# Altium schematic sheet REB215_XPRO_A_Connector.SchDoc: REB215_XPRO_A_Extension_Schematic
size A3; Organization: ATMEL R&D India; Address1: Kandanchavadi; Address3: Chennai; DocumentNumber: A09-2353; Revision: 2; SheetNumber: 2; SheetTotal: 3; PageSetup: Record=PageOptions|CenterHorizontal=True|CenterVertical=True|PrintScale=1.01|XCorrection=1.00|YCorrection=1.00|PrintKind=1|BorderSize=5000000|LeftOffset=0|BottomOffset=0|Orientation=2|PaperLength=1000|PaperWidth=1000|Scale=100|PaperSource=7|PrintQuality=-4|MediaType=1|DitherType=10|PaperKind=A3 (297 x 420 mm)|PrintScaleMode=1; DocumentName: REB215_XPRO_Extension_A
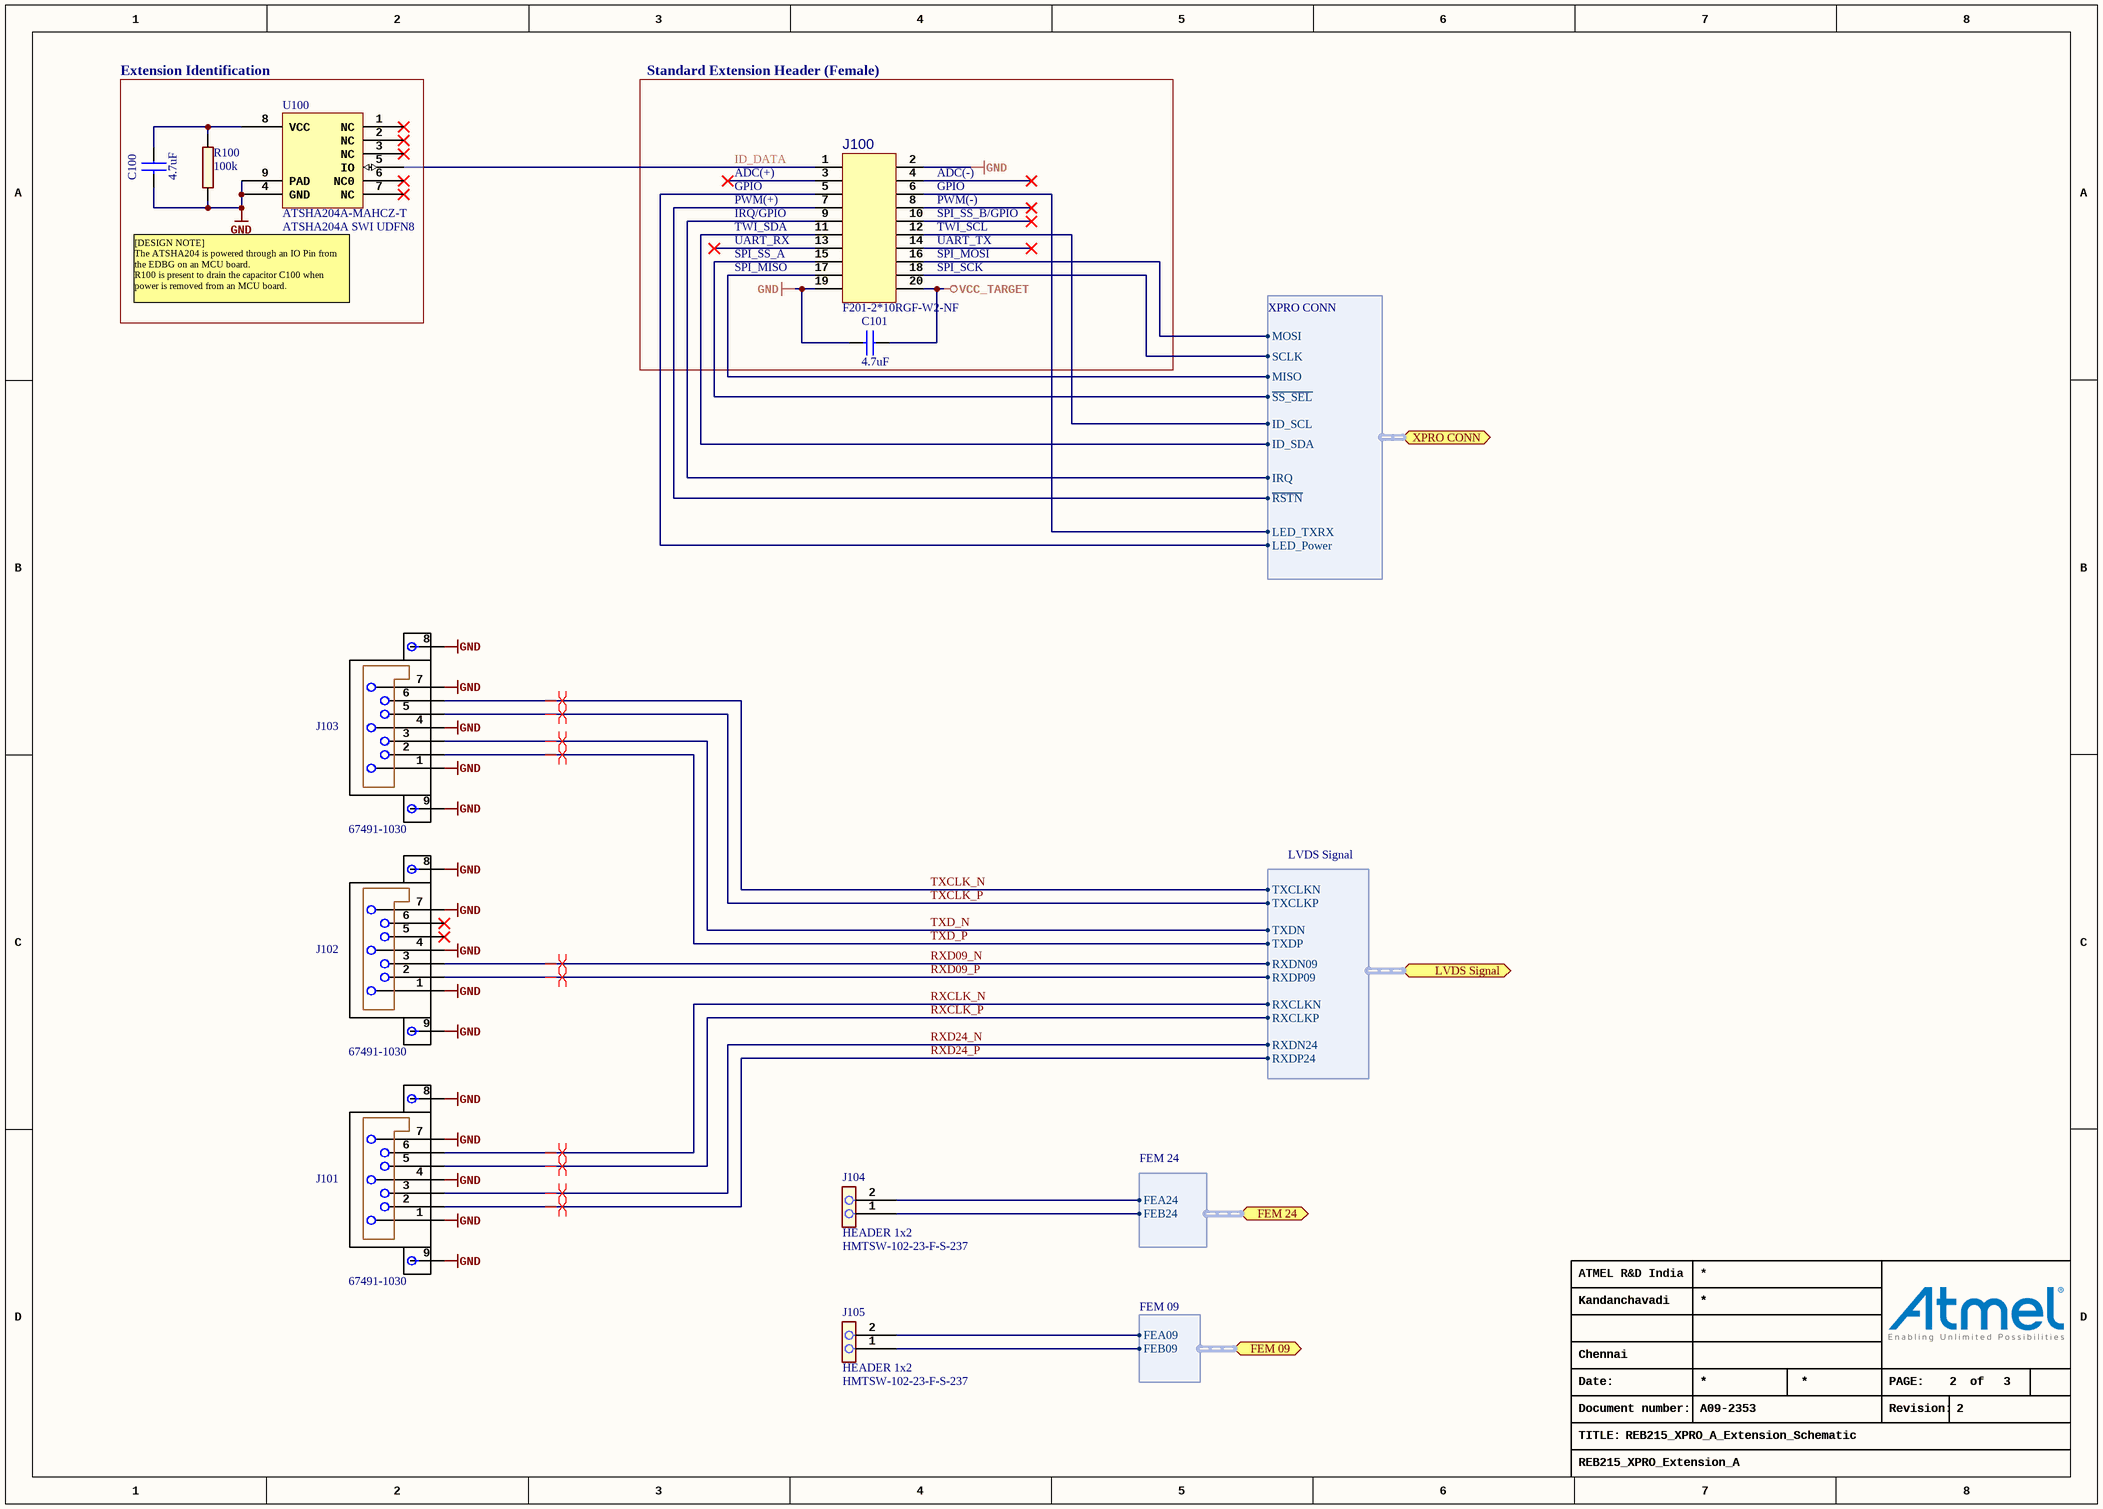
[diagram p0: REB215_XPRO_A_Connector.SchDoc]

## Parts
C100  value 4.7uF  [AP1-00001]  (hidden comment: Recommended by Escatec. No datasheet available yet.)
C101  value 4.7uF  [AP1-00001]  (hidden comment: Recommended by Escatec. No datasheet available yet.)
J100  value F201-2*10RGF-W2-NF  [AP8-00621]  (hidden comment: HEADER-2X10)
J101  value 67491-1030  [AP8-00746]  (hidden comment: SATA_7PIN_HEADER)
J102  value 67491-1030  [AP8-00746]  (hidden comment: SATA_7PIN_HEADER)
J103  value 67491-1030  [AP8-00746]  (hidden comment: SATA_7PIN_HEADER)
J104  HEADER 1x2  value HMTSW-102-23-F-S-237  [AP8-00733]
J105  HEADER 1x2  value HMTSW-102-23-F-S-237  [AP8-00733]
R100  value 100k  [AP2-00000]  (hidden comment: R2)
U100  ATSHA204A-MAHCZ-T  value ATSHA204A SWI UDFN8  [AP6-00409]

## Blocks framed on the sheet
Extension Identification: C100 R100 U100
Standard Extension Header (Female): C101 J100

## Ports
FEM 09 (harness FEM 09), FEM 24 (harness FEM 24), LVDS Signal (harness LVDS Signal), XPRO CONN (harness XPRO CONN)

## Harnesses
XPRO CONN: ID_SCL, ID_SDA, ~{SS_SEL}, MOSI, MISO, SCLK, ~{RSTN}, IRQ, LED_Power, LED_TXRX
FEM 24: FEA24, FEB24
FEM 09: FEA09, FEB09
LVDS Signal: TXCLKN, TXCLKP, TXDN, TXDP, RXDN09, RXDP09, RXCLKN, RXCLKP, RXDN24, RXDP24

## Nets
GND: C100.2 C101.2 J100.2 J100.19 J101.1 J101.4 J101.7 J101.8 J101.9 J102.1 J102.4 J102.7 J102.8 J102.9 J103.1 J103.4 J103.7 J103.8 J103.9 R100.1 U100.4(GND) U100.9(PAD)
VCC_TARGET: C101.1 J100.20
ID_DATA: J100.1 U100.5(IO)
RXCLK_N: J101.6 ; port LVDS Signal.RXCLKN
RXCLK_P: J101.5 ; port LVDS Signal.RXCLKP
RXD09_N: J102.3 ; port LVDS Signal.RXDN09
RXD09_P: J102.2 ; port LVDS Signal.RXDP09
RXD24_N: J101.3 ; port LVDS Signal.RXDN24
RXD24_P: J101.2 ; port LVDS Signal.RXDP24
TXCLK_N: J103.6 ; port LVDS Signal.TXCLKN
TXCLK_P: J103.5 ; port LVDS Signal.TXCLKP
TXD_N: J103.3 ; port LVDS Signal.TXDN
TXD_P: J103.2 ; port LVDS Signal.TXDP
NetC100_1: C100.1 R100.2 U100.8(VCC)
NetJ100_5: J100.5 ; port XPRO CONN.LED_Power
NetJ100_6: J100.6 ; port XPRO CONN.LED_TXRX
NetJ100_7: J100.7 ; port XPRO CONN.~{RSTN}
NetJ100_9: J100.9 ; port XPRO CONN.IRQ
NetJ100_11: J100.11 ; port XPRO CONN.ID_SDA
NetJ100_12: J100.12 ; port XPRO CONN.ID_SCL
NetJ100_15: J100.15 ; port XPRO CONN.~{SS_SEL}
NetJ100_16: J100.16 ; port XPRO CONN.MOSI
NetJ100_17: J100.17 ; port XPRO CONN.MISO
NetJ100_18: J100.18 ; port XPRO CONN.SCLK
NetJ104_1: J104.1 ; port FEM 24.FEB24
NetJ104_2: J104.2 ; port FEM 24.FEA24
NetJ105_1: J105.1 ; port FEM 09.FEB09
NetJ105_2: J105.2 ; port FEM 09.FEA09

Not connected (* = marked no-connect by the designer): J100 3* 4* 8* 10* 13* 14*; J102 5* 6*; U100 1(NC)* 2(NC)* 3(NC)* 6(NC0)* 7(NC)*

## Layout directives
differential pair: RXCLK_N, RXCLK_P, RXD09_N, RXD09_P, RXD24_N, RXD24_P, TXCLK_N, TXCLK_P, TXD_N, TXD_P

## Notes on the sheet
- ADC(+)
- (near J100) ADC(-)
- PWM(+)
- GPIO
- TWI_SDA
- UART_RX
- IRQ/GPIO
- (near J100) PWM(-)
- (near J100) GPIO
- (near J100) TWI_SCL
- (near J100) UART_TX
- (near J100) SPI_SS_B/GPIO
- [DESIGN NOTE]
  The ATSHA204 is powered through an IO Pin from the EDBG on an MCU board.
  R100 is present to drain the capacitor C100 when power is removed from an MCU board.
- SPI_SS_A
- SPI_MISO
- (near J100) SPI_MOSI
- (near J100) SPI_SCK
- Date:
- PAGE:
- of
- TITLE:
- Document number:
- Revision:

## Library data of the parts
C100 C101 = A01-0347: Ceramic capacitor, SMD 0402, X5R, 6.3V, +/-20% (de33687); PartGroup: Capacitors,Ceramic,SMD 0402; Manufacturer: Murata; MPN: GRM155R60J475ME87D; Tolerance: +-20%; TemperatureRange: -55°C to +85°C; ComponentStatus: 'Active (verified)'; Status: Active; Verified by: Lars Helge Mo; Verified date: 2005-12-15; AN: A01-0347; Height: 0,5; FootprintStatus: 'Active (Verified)'
J100 = A08-1512: 2x10, female pin header receptable, right-angled, 2.54mm pitch, THM, Pin In Paste; PartGroup: Mechanical devices,Connectors,Pin header receptacle; Manufacturer: Pro-data International Corp; ComponentStatus: 'Active (verified)'; Verified by: *; Verified date: *; AN: A08-1512; Height: 5.07999992370605; MPN: F201-2*10RGF-W2-NF; FootprintStatus: 'Active (Verified)'
J101-J103 = A08-1789: 1.27mm Pitch Serial ATA High Speed Header, Through Hole, Vertical, 7 Circuits; PartGroup: Mechanical devices,Connectors,Memory cards; Manufacturer: Molex; ComponentStatus: 'Active (verified)'; Status: Valid; Verified by: vlarsen; Verified date: 2011-06-01; AN: A08-1789; Height: 8.39999961853027; MPN: 67491-1030; FootprintStatus: 'New (Not verified)'
J104 J105 = A08-1754: 1x2 pin header, 2.54mm pitch, Pin-in-Paste THM; PartGroup: Mechanical devices,Connectors,Pin headers; Manufacturer: SAMTEC; TemperatureRange: - 55 deg C to + 125 deg C; ComponentStatus: 'Active (verified)'; Verified date: 2006-01-30; Verified by: Lars Helge; Status: Active; AN: A08-1754; Height: 6.09999990463257; MPN: HMTSW-102-23-F-S-237; FootprintStatus: 'Active (Verified)'
R100 = A02-0260: Thick film resistor, SMD 0402, 1/16W, 1%; PartGroup: Resistors,SMD,0402 1%; TemperatureRange: -55ï¿½ to +125ï¿½C; ComponentStatus: 'Active (verified)'; Status: Active; Verified by: Lars Helge Mo; Verified date: 2005-12-19; AN: A02-0260; Tolerance: 1 %; Height: 0.349999994039536; FootprintStatus: 'Active (Verified)'
U100 = A06-1276: ATSHA204A with 1-wire interface and UDFN8 package; PartGroup: Integrated Circuits,Special function,Encryption; Manufacturer: ATMEL; ComponentStatus: 'Active (verified)'; Status: New; Verified by: VL; Verified date: 2015-01-27; AN: A06-1276; Height: 0.600000023841858; MPN: ATSHA204A-MAHCZ-T; FootprintStatus: 'Active (Verified)'